# EAGLE design speculator_minor_mainboard_76mm_v1 (EAGLE 9.6.2)
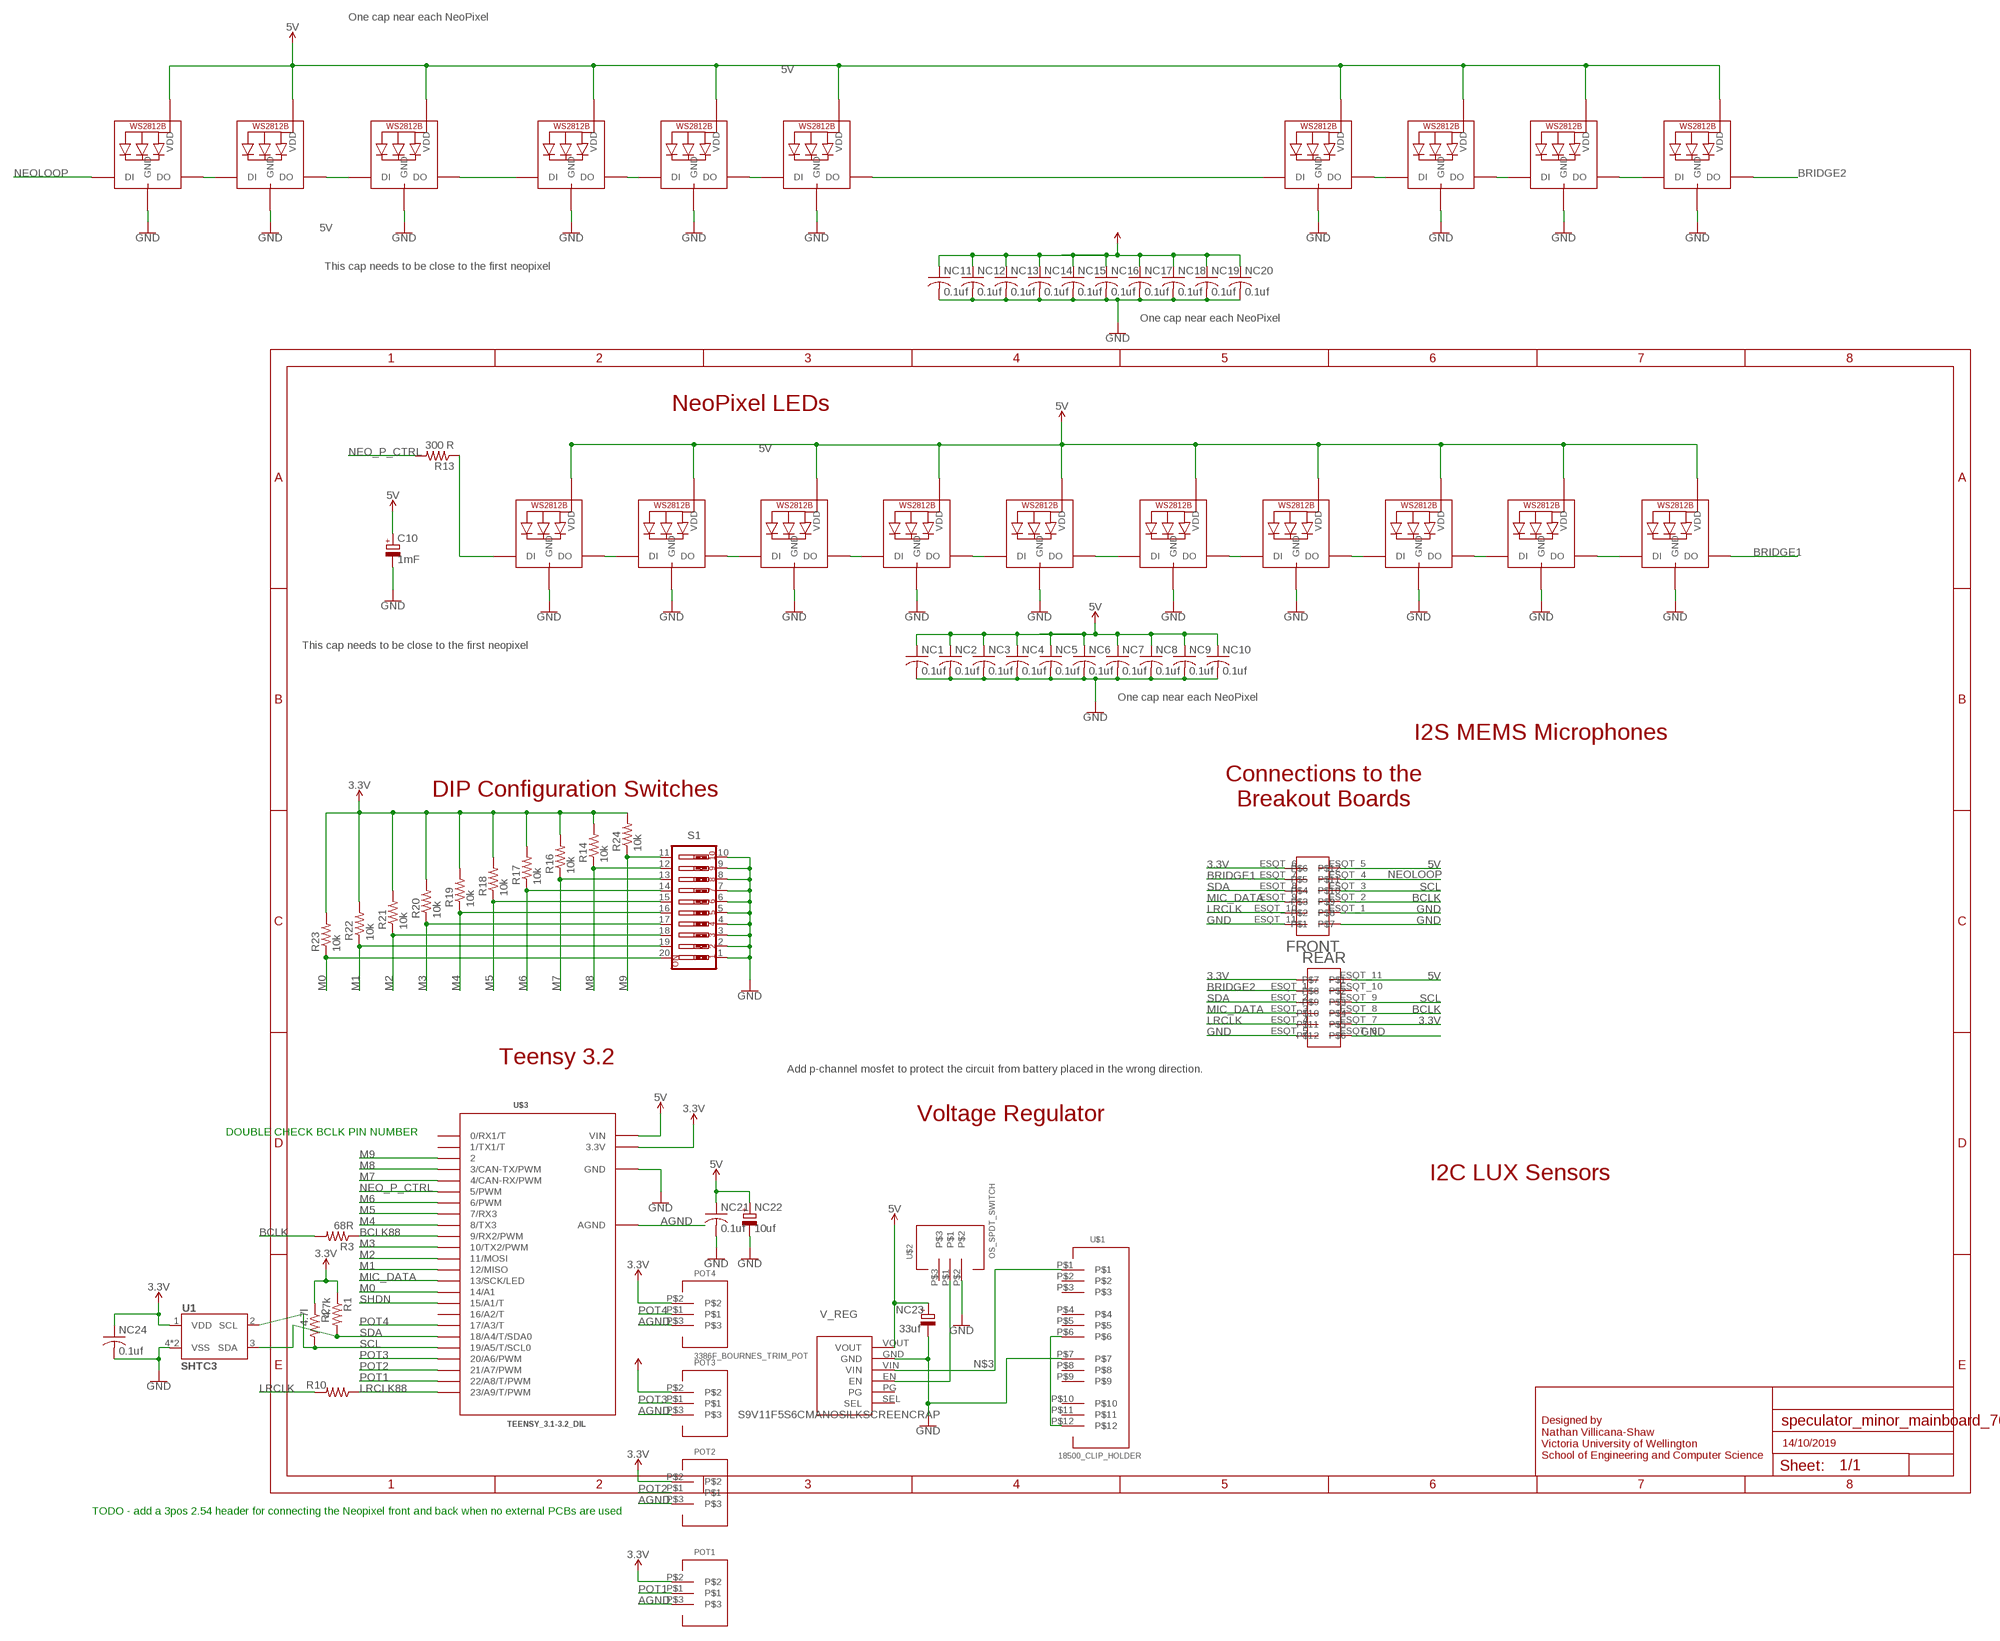
[diagram p0: schematic, sheet 1, part 1 of 2]
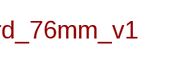
[diagram p1: schematic, sheet 1, part 2 of 2]

## Parts
C10  1mF  CPOL-EU153CLV-1010  [153CLV-1010]
FRONT  SAMTEC_ESQT_2X6_THROUGH_HOLE  [SAMTEC_ESQT_2X6_THROUGH_HOLE]
NC1  0.1uf  C-USC0805K  [C0805K]
NC2  0.1uf  C-USC0805K  [C0805K]
NC3  0.1uf  C-USC0805K  [C0805K]
NC4  0.1uf  C-USC0805K  [C0805K]
NC5  0.1uf  C-USC0805K  [C0805K]
NC6  0.1uf  C-USC0805K  [C0805K]
NC7  0.1uf  C-USC0805K  [C0805K]
NC8  0.1uf  C-USC0805K  [C0805K]
NC9  0.1uf  C-USC0805K  [C0805K]
NC10  0.1uf  C-USC0805K  [C0805K]
NC11  0.1uf  C-USC0805K  [C0805K]
NC12  0.1uf  C-USC0805K  [C0805K]
NC13  0.1uf  C-USC0805K  [C0805K]
NC14  0.1uf  C-USC0805K  [C0805K]
NC15  0.1uf  C-USC0805K  [C0805K]
NC16  0.1uf  C-USC0805K  [C0805K]
NC17  0.1uf  C-USC0805K  [C0805K]
NC18  0.1uf  C-USC0805K  [C0805K]
NC19  0.1uf  C-USC0805K  [C0805K]
NC20  0.1uf  C-USC0805K  [C0805K]
NC21  0.1uf  C-USC0805K  [C0805K]
NC22  10uf  CPOL-EUE2.5-7  [E2,5-7]
NC23  33uf  CPOL-EUE2.5-7  [E2,5-7]
NC24  0.1uf  C-USC0805K  [C0805K]
NEO1  WS2812B5050  [WS2812B]
NEO2  WS2812B5050  [WS2812B]
NEO3  WS2812B5050  [WS2812B]
NEO4  WS2812B5050  [WS2812B]
NEO5  WS2812B5050  [WS2812B]
NEO6  WS2812B5050  [WS2812B]
NEO7  WS2812B5050  [WS2812B]
NEO8  WS2812B5050  [WS2812B]
NEO9  WS2812B5050  [WS2812B]
NEO10  WS2812B5050  [WS2812B]
NEO11  WS2812B5050  [WS2812B]
NEO12  WS2812B5050  [WS2812B]
NEO13  WS2812B5050  [WS2812B]
NEO14  WS2812B5050  [WS2812B]
NEO15  WS2812B5050  [WS2812B]
NEO16  WS2812B5050  [WS2812B]
NEO17  WS2812B5050  [WS2812B]
NEO18  WS2812B5050  [WS2812B]
NEO19  WS2812B5050  [WS2812B]
NEO20  WS2812B5050  [WS2812B]
POT1  3386F_BOURNES_TRIM_POT  [3386_BOURNS_TRIM_POT]
POT2  3386F_BOURNES_TRIM_POT  [3386_BOURNS_TRIM_POT]
POT3  3386F_BOURNES_TRIM_POT  [3386_BOURNS_TRIM_POT]
POT4  3386F_BOURNES_TRIM_POT  [3386_BOURNS_TRIM_POT]
R1  4.7k  R-US_R0805  [R0805]
R2  4.7l  R-US_R0805  [R0805]
R3  68R  R-US_R0805  [R0805]
R10  68R  R-US_R0805  [R0805]
R13  300 R  R-US_R0805  [R0805]
R14  10k  R-US_R0805  [R0805]
R16  10k  R-US_R0805  [R0805]
R17  10k  R-US_R0805  [R0805]
R18  10k  R-US_R0805  [R0805]
R19  10k  R-US_R0805  [R0805]
R20  10k  R-US_R0805  [R0805]
R21  10k  R-US_R0805  [R0805]
R22  10k  R-US_R0805  [R0805]
R23  10k  R-US_M0805  [M0805]
R24  10k  R-US_R0805  [R0805]
REAR  SAMTEC_ESQT_2X6_THROUGH_HOLE  [SAMTEC_ESQT_2X6_THROUGH_HOLE]
S1  SW_DIP-10  [EDG-10]
U1  SHTC3  [SHTC3]
U$1  18500_CLIP_HOLDER  [3PINBATTERY_CLIP]
U$2  OS_SPDT_SWITCH  [OS_SPDT_SLIDE_SWITCH]
U$3  TEENSY_3.1-3.2_DIL  [TEENSY_3.0-3.2&LC_DIL]
V_REG  S9V11F5S6CMANOSILKSCREENCRAP  [S9V11F3S5CMA_BETTER_PINS]

## Nets
3.3V: FRONT.ESQT_6 NC24.1 POT1.P$2 POT2.P$2 POT3.P$2 POT4.P$2 R1.1 R2.1 R14.2 R16.2 R17.2 R18.2 R19.2 R20.2 R21.2 R22.2 R23.2 R24.2 REAR.ESQT_0 REAR.ESQT_7 U1.1(VDD) U$3.3.3V
5V: C10.+ FRONT.ESQT_5 NC1.1 NC2.1 NC3.1 NC4.1 NC5.1 NC6.1 NC7.1 NC8.1 NC9.1 NC10.1 NC11.1 NC12.1 NC13.1 NC14.1 NC15.1 NC16.1 NC17.1 NC18.1 NC19.1 NC20.1 NC21.1 NC22.+ NC23.+ NEO1.1-VDD(VDD) NEO2.1-VDD(VDD) NEO3.1-VDD(VDD) NEO4.1-VDD(VDD) NEO5.1-VDD(VDD) NEO6.1-VDD(VDD) NEO7.1-VDD(VDD) NEO8.1-VDD(VDD) NEO9.1-VDD(VDD) NEO10.1-VDD(VDD) NEO11.1-VDD(VDD) NEO12.1-VDD(VDD) NEO13.1-VDD(VDD) NEO14.1-VDD(VDD) NEO15.1-VDD(VDD) NEO16.1-VDD(VDD) NEO17.1-VDD(VDD) NEO18.1-VDD(VDD) NEO19.1-VDD(VDD) NEO20.1-VDD(VDD) REAR.ESQT_11 U$3.VIN V_REG.VOUT
AGND: POT1.P$3 POT2.P$3 POT3.P$3 POT4.P$3 U$3.AGND
BCLK: FRONT.ESQT_2 R3.2 REAR.ESQT_8
BCLK88: R3.1 U$3.9(9/RX2/PWM)
BRIDGE1: FRONT.ESQT_7 NEO10.2-DOUT(DO)
BRIDGE2: NEO20.2-DOUT(DO) REAR.ESQT_1
GND: C10.- FRONT.ESQT_0 FRONT.ESQT_1 FRONT.ESQT_11 NC1.2 NC2.2 NC3.2 NC4.2 NC5.2 NC6.2 NC7.2 NC8.2 NC9.2 NC10.2 NC11.2 NC12.2 NC13.2 NC14.2 NC15.2 NC16.2 NC17.2 NC18.2 NC19.2 NC20.2 NC21.2 NC22.- NC23.- NC24.2 NEO1.3-GND(GND) NEO2.3-GND(GND) NEO3.3-GND(GND) NEO4.3-GND(GND) NEO5.3-GND(GND) NEO6.3-GND(GND) NEO7.3-GND(GND) NEO8.3-GND(GND) NEO9.3-GND(GND) NEO10.3-GND(GND) NEO11.3-GND(GND) NEO12.3-GND(GND) NEO13.3-GND(GND) NEO14.3-GND(GND) NEO15.3-GND(GND) NEO16.3-GND(GND) NEO17.3-GND(GND) NEO18.3-GND(GND) NEO19.3-GND(GND) NEO20.3-GND(GND) REAR.ESQT_5 REAR.ESQT_6 S1.1 S1.2 S1.3 S1.4 S1.5 S1.6 S1.7 S1.8 S1.9 S1.10 U1.4(VSS) U1.5(VSS) U$1.P$7 U$2.P$2 U$3.GND V_REG.GND
LRCLK: FRONT.ESQT_10 R10.2 REAR.ESQT_4
LRCLK88: R10.1 U$3.23/A9(23/A9/T/PWM)
M0: R23.1 S1.20 U$3.14/A0(14/A1)
M1: R22.1 S1.19 U$3.12(12/MISO)
M2: R21.1 S1.18 U$3.11(11/MOSI)
M3: R20.1 S1.17 U$3.10(10/TX2/PWM)
M4: R19.1 S1.16 U$3.8(8/TX3)
M5: R18.1 S1.15 U$3.7(7/RX3)
M6: R17.1 S1.14 U$3.6(6/PWM)
M7: R16.1 S1.13 U$3.4(4/CAN-RX/PWM)
M8: R14.1 S1.12 U$3.3(3/CAN-TX/PWM)
M9: R24.1 S1.11 U$3.2
MIC_DATA: FRONT.ESQT_9 REAR.ESQT_3 U$3.13(13/SCK/LED)
N$1: U$1.P$6 U$1.P$12
N$3: U$1.P$1 V_REG.VIN
N$4: NEO2.2-DOUT(DO) NEO3.4-DIN(DI)
N$5: NEO5.2-DOUT(DO) NEO6.4-DIN(DI)
N$6: NEO9.2-DOUT(DO) NEO10.4-DIN(DI)
N$7: NEO11.2-DOUT(DO) NEO12.4-DIN(DI)
N$8: NEO4.2-DOUT(DO) NEO5.4-DIN(DI)
N$9: NEO15.2-DOUT(DO) NEO16.4-DIN(DI)
N$10: NEO3.2-DOUT(DO) NEO4.4-DIN(DI)
N$11: NEO7.2-DOUT(DO) NEO8.4-DIN(DI)
N$12: NEO8.2-DOUT(DO) NEO9.4-DIN(DI)
N$14: NEO18.2-DOUT(DO) NEO19.4-DIN(DI)
N$15: NEO13.2-DOUT(DO) NEO14.4-DIN(DI)
N$16: NEO16.2-DOUT(DO) NEO17.4-DIN(DI)
N$18: NEO12.2-DOUT(DO) NEO13.4-DIN(DI)
N$19: NEO19.2-DOUT(DO) NEO20.4-DIN(DI)
N$23: NEO6.2-DOUT(DO) NEO7.4-DIN(DI)
N$1343: NEO17.2-DOUT(DO) NEO18.4-DIN(DI)
NEO_P1: NEO1.2-DOUT(DO) NEO2.4-DIN(DI)
NEO_P2: NEO14.2-DOUT(DO) NEO15.4-DIN(DI)
NEO_P_CTRL: R13.2 U$3.5(5/PWM)
NEO_P_CTRL_INT: NEO1.4-DIN(DI) R13.1
NEOLOOP: FRONT.ESQT_4 NEO11.4-DIN(DI)
POT1: POT1.P$1 U$3.22/A8(22/A8/T/PWM)
POT2: POT2.P$1 U$3.21/A7(21/A7/PWM)
POT3: POT3.P$1 U$3.20/A6(20/A6/PWM)
POT4: POT4.P$1 U$3.17/A3(17/A3/T)
SCL: FRONT.ESQT_3 R2.2 REAR.ESQT_9 U1.2(SCL) U$3.19/A5(19/A5/T/SCL0)
SDA: FRONT.ESQT_8 R1.2 REAR.ESQT_2 U1.3(SDA) U$3.18/A4(18/A4/T/SDA0)
SHDN: U$2.P$1 U$3.15/A1(15/A1/T) V_REG.EN
Unconnected: REAR.ESQT_10 U$1.P$2 U$1.P$3 U$1.P$4 U$1.P$5 U$1.P$8 U$1.P$9 U$1.P$10 U$1.P$11 U$2.P$3 U$3.0(0/RX1/T) U$3.1(1/TX1/T) U$3.16/A2(16/A2/T) V_REG.PG V_REG.SEL

## Notes on the sheet
- One cap near each NeoPixel
- This cap needs to be close to the first neopixel
- One cap near each NeoPixel
- NeoPixel LEDs
- This cap needs to be close to the first neopixel
- One cap near each NeoPixel
- I2S MEMS Microphones
- Connections to the
  Breakout Boards
- DIP Configuration Switches
- Teensy 3.2
- Add p-channel mosfet to protect the circuit from battery placed in the wrong direction.
- Voltage Regulator
- DOUBLE CHECK BCLK PIN NUMBER
- I2C LUX Sensors
- 14/10/2019
- Designed by
  Nathan Villicana-Shaw
  Victoria University of Wellington
  School of Engineering and Computer Science
- TODO - add a 3pos 2.54 header for connecting the Neopixel front and back when no external PCBs are used

## Library data of the parts
C10 NC22 NC23 = rcl:CPOL-EU: POLARIZED CAPACITOR, European symbol; SPICEPREFIX: C
FRONT REAR = nathans-custom-parts:SAMTEC_ESQT_2X6_THROUGH_HOLE
NC1-NC21 NC24 = resistor:C-US: CAPACITOR, American symbol
NEO1-NEO20 = nathans-custom-parts:WS2812B
POT1-POT4 = nathans-custom-parts:3386F_BOURNES_TRIM_POT
R1-R3 R10 R13 R14 R16-R22 R24 = audio amplifier example:R-US_: RESISTOR, American symbol
R23 = resistor:R-US_: RESISTOR, American symbol
S1 = special:SW_DIP-10: DIP SWITCH
U1 = SHTC3:SHTC3
U$1 = nathans-custom-parts:18500_CLIP_HOLDER; SPICEPREFIX: X
U$2 = nathans-custom-parts:OS_SPDT_SWITCH
U$3 = Teensy_3_and_LC_Series_Boards_v1.4:TEENSY_3.1-3.2_DIL: Teensy 3.1 or 3.2 in a DIL Layout.
V_REG = nathans-custom-parts:S9V11F5S6CMA

## Net classes
0 default: width 0.203 mm, drill 0.254 mm, clearance 0.152 mm

## Board
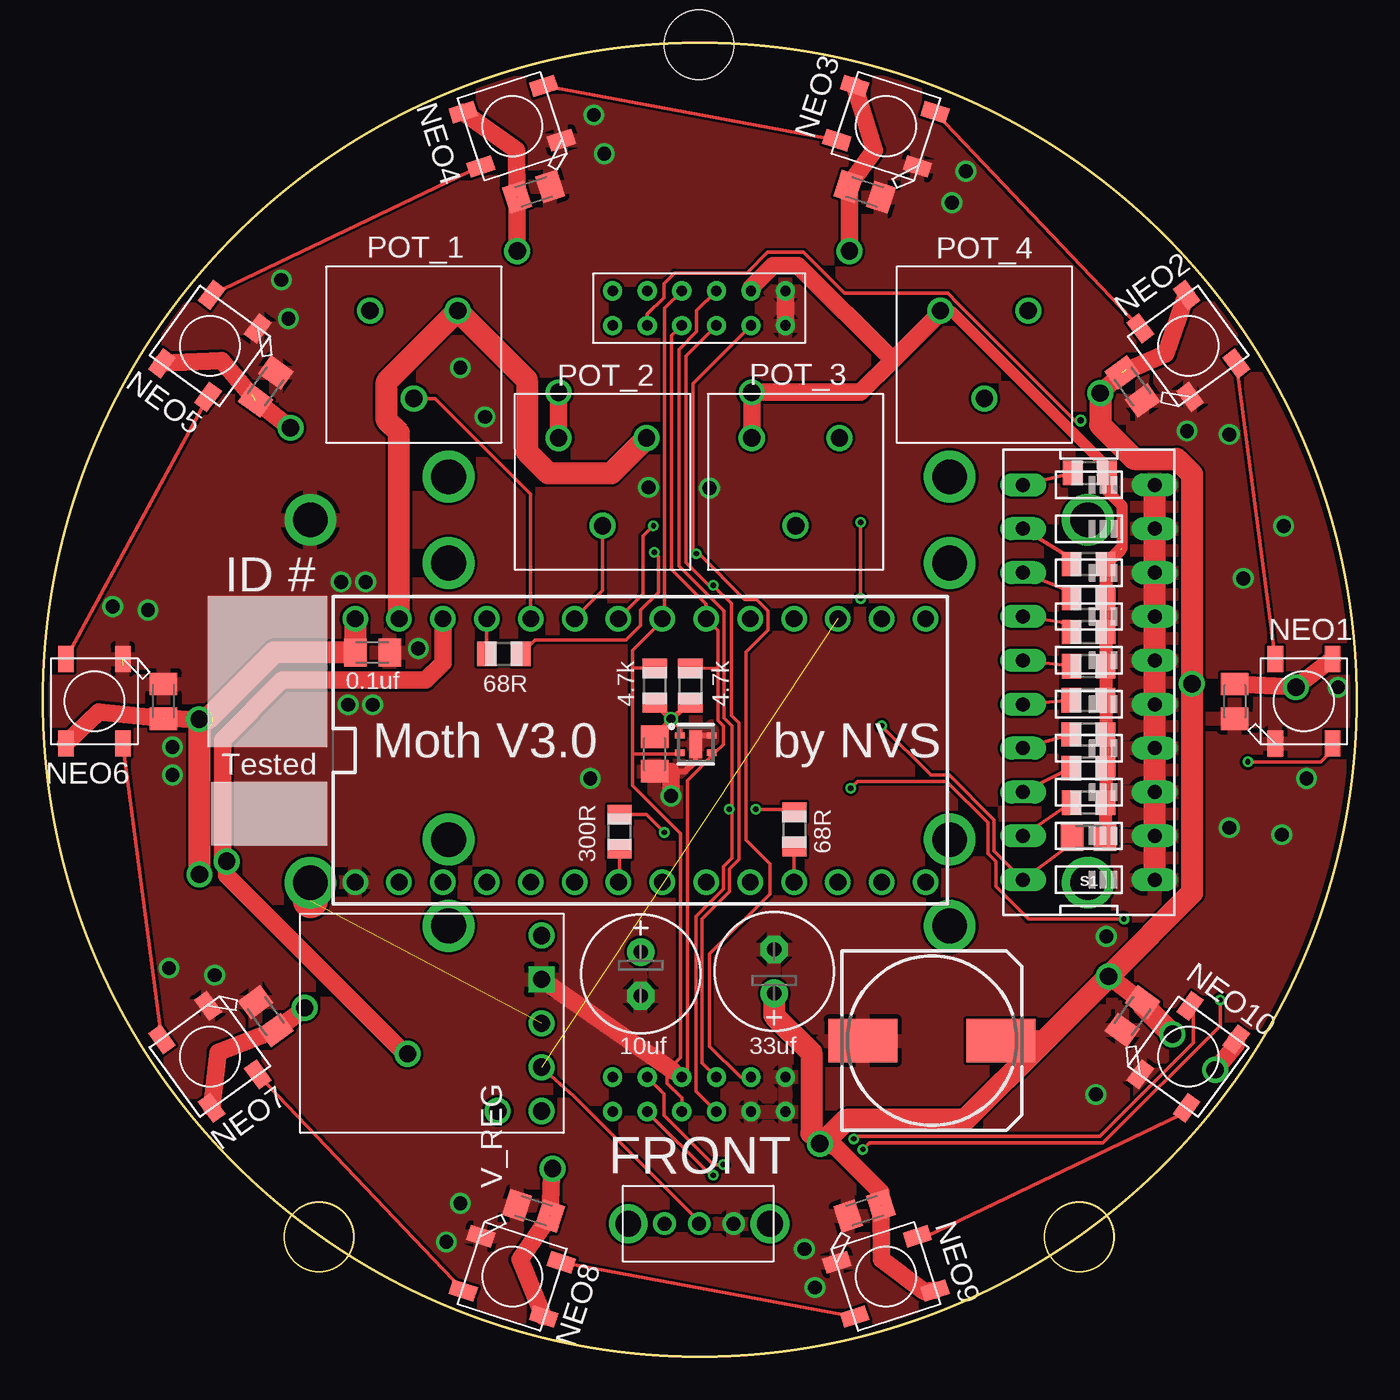
[diagram p2: board, top side]
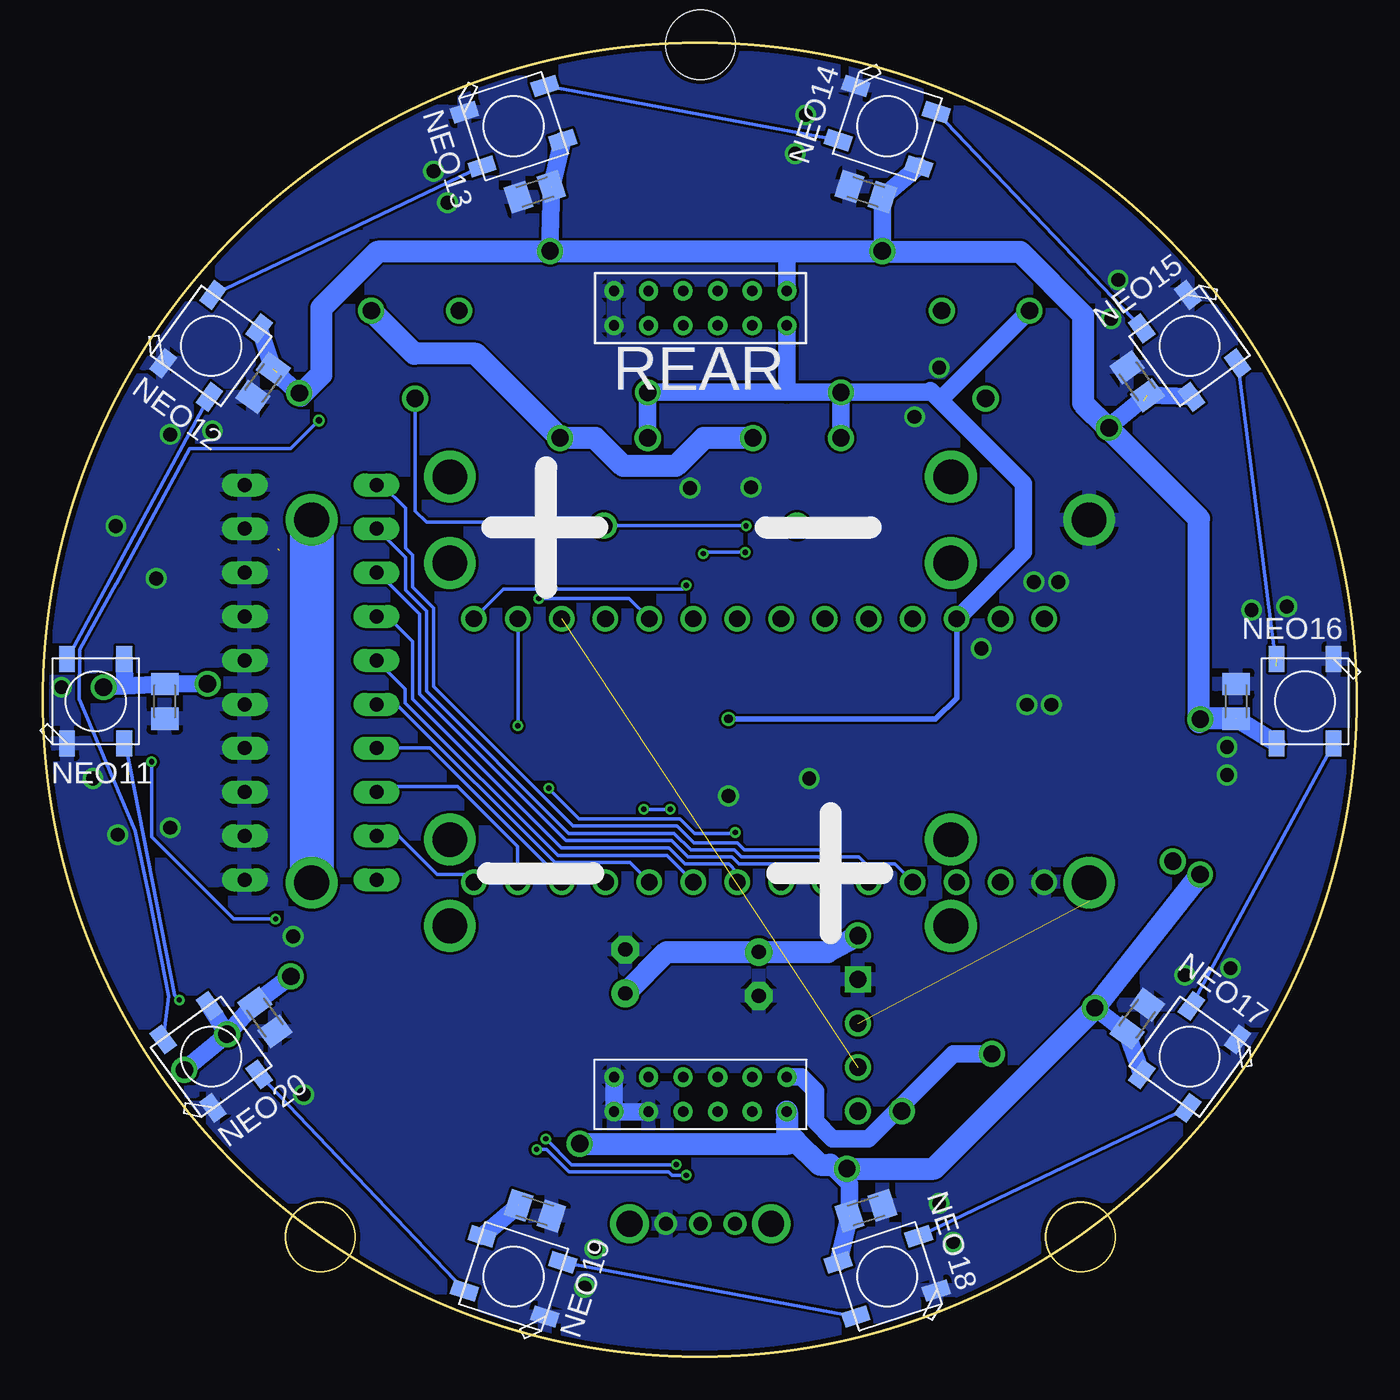
[diagram p3: board, bottom side, seen from below]

Size 76 x 76 mm. Coordinates in mm from the lower left corner, seen from the top.
Outline: circle at 15.96,6.91 radius 2
Outline: circle at 59.96,6.91 radius 2
Outline: circle at 38,38 radius 38
Copper layers (1*16): Top 0.035mm / dielectric 1.5mm / Bottom 0.035mm
Design rules "SeeedStudio_2layer_DRU_no_angle_20140221": minimum track width 6mil, minimum drill 12mil, track to track 6mil, track to pad 6mil, pad to pad 6mil, via to via 6mil, smd to smd 0mil, copper to edge 10mil, drill to drill 10mil, minimum pad ring 10mil, minimum via ring 6mil, stop-mask expansion 2mil, vias tented up to drill 100mil, thermal gap 10mil
Holes 4 mm at 15.96,6.91 59.96,6.91 37.96,75.91

### Footprints (pad centres in the part's own frame; a part is rotated, then mirrored left to right if it is on the bottom)
153CLV-1010 = smd 4 x 2.5: + 4,0; - -4,0
SAMTEC_ESQT_2X6_THROUGH_HOLE = drill 0.6: ESQT_0 -5,-1; ESQT_1 -3,-1; ESQT_2 -1,-1; ESQT_3 1,-1; ESQT_4 3,-1; ESQT_5 5,-1; ESQT_6 5,1; ESQT_7 3,1; ESQT_8 1,1; ESQT_9 -1,1; ESQT_10 -3,1; ESQT_11 -5,1
C0805K = smd 1.3 x 1.6: 1 -1,0; 2 1,0
E2,5-7 = drill 0.813 pad 1.6: + -1.27,0 | drill 0.813 pad 1.6 octagon: - 1.27,0
WS2812B = smd 1.5 x 0.9: 1-VDD 2.45,-1.65; 2-DOUT 2.45,1.65; 3-GND -2.45,1.65; 4-DIN -2.45,-1.65
3386_BOURNS_TRIM_POT = drill 1: P$1 0,-2.54; P$2 -2.54,2.54; P$3 2.54,2.54
R0805 = smd 1.1 x 1.4: 1 -1,0; 2 1,0
M0805 = smd 1.3 x 1.6: 1 -0.95,0; 2 0.95,0
EDG-10 = drill 0.813 long: 1 -11.43,-3.81; 2 -8.89,-3.81; 3 -6.35,-3.81; 4 -3.81,-3.81; 5 -1.27,-3.81; 6 1.27,-3.81; 7 3.81,-3.81; 8 6.35,-3.81; 9 8.89,-3.81; 10 11.43,-3.81; 11 11.43,3.81; 12 8.89,3.81; 13 6.35,3.81; 14 3.81,3.81; 15 1.27,3.81; 16 -1.27,3.81; 17 -3.81,3.81; 18 -6.35,3.81; 19 -8.89,3.81; 20 -11.43,3.81
SHTC3 = smd 0.55 x 0.35: 1 -0.925,0.5; 2 -0.925,-0.5; 3 0.925,-0.5; 4 0.925,0.5 | smd 0.7 x 1.6: 5 0,0
3PINBATTERY_CLIP = drill 2: P$1 -22.5,10.5; P$2 -14.5,13; P$3 -14.5,8; P$4 14.5,13; P$5 14.5,8; P$6 22.5,10.5; P$7 -22.5,-10.5; P$8 -14.5,-8; P$9 -14.5,-13; P$10 14.5,-8; P$11 14.5,-13; P$12 22.5,-10.5
OS_SPDT_SLIDE_SWITCH = drill 0.8: P$1 0,0; P$2 2,0; P$3 -2,0 | drill 1.5: P$4 4.1,0; P$5 -4.1,0
TEENSY_3.0-3.2&LC_DIL = drill 0.965: 0 -7.62,13.97; 1 -7.62,11.43; 2 -7.62,8.89; 3 -7.62,6.35; 3.3V 7.62,11.43; 4 -7.62,3.81; 5 -7.62,1.27; 6 -7.62,-1.27; 7 -7.62,-3.81; 8 -7.62,-6.35; 9 -7.62,-8.89; 10 -7.62,-11.43; 11 -7.62,-13.97; 12 -7.62,-16.51; 13 7.62,-16.51; 14/A0 7.62,-13.97; 15/A1 7.62,-11.43; 16/A2 7.62,-8.89; 17/A3 7.62,-6.35; 18/A4 7.62,-3.81; 19/A5 7.62,-1.27; 20/A6 7.62,1.27; 21/A7 7.62,3.81; 22/A8 7.62,6.35; 23/A9 7.62,8.89; AGND 7.62,13.97; GND -7.62,16.51; VIN 7.62,16.51
S9V11F3S5CMA_BETTER_PINS = drill 1: EN 3.81,1.27; PG 1.27,1.27; SEL 1.27,3.81; VIN 6.35,1.27; VOUT 11.43,1.27 | drill 1 square: GND 8.89,1.27

### Placement (x,y rotation side)
C10  51.44,18.27 0 top
FRONT  37.96,15.16 0 bottom
NC1  68.96,37.91 270 top
NC2  63.04,56.13 306 top
NC3  47.54,67.39 342 top
NC4  28.38,67.39 18 top
NC5  12.88,56.13 54 top
NC6  6.96,37.91 90 top
NC7  12.88,19.69 126 top
NC8  28.38,8.43 162 top
NC9  47.54,8.43 198 top
NC10  63.04,19.69 234 top
NC11  68.96,37.91 270 bottom
NC12  63.27,56.34 234 bottom
NC13  47.54,67.39 198 bottom
NC14  28.38,67.39 162 bottom
NC15  12.68,56.44 126 bottom
NC16  6.96,37.91 90 bottom
NC17  12.68,19.54 54 bottom
NC18  28.38,8.43 18 bottom
NC19  47.54,8.43 342 bottom
NC20  63.17,19.61 306 bottom
NC21  19.06,40.74 0 top
NC22  34.59,22.13 270 top
NC23  42.31,22.27 90 top
NC24  35.39,34.86 270 top
NEO1  72.96,37.91 90 top
NEO2  66.28,58.48 126 top
NEO3  48.78,71.2 162 top
NEO4  27.15,71.2 198 top
NEO5  9.65,58.48 234 top
NEO6  2.96,37.91 270 top
NEO7  9.65,17.34 306 top
NEO8  27.15,4.62 342 top
NEO9  48.78,4.62 18 top
NEO10  66.28,17.34 54 top
NEO11  72.96,37.91 90 bottom
NEO12  66.28,58.48 54 bottom
NEO13  48.78,71.2 18 bottom
NEO14  27.15,71.2 342 bottom
NEO15  9.65,58.48 306 bottom
NEO16  2.96,37.91 270 bottom
NEO17  9.65,17.34 234 bottom
NEO18  27.15,4.62 198 bottom
NEO19  48.78,4.62 162 bottom
NEO20  66.28,17.34 126 bottom
POT1  21.45,57.98 0 top
POT2  32.37,50.61 0 top
POT3  43.55,50.61 0 top
POT4  54.47,57.98 0 top
R1  37.45,38.83 90 top
R2  35.4,38.83 90 top
R3  43.47,30.49 90 top
R10  26.66,40.66 0 top
R13  33.35,30.35 270 top
R14  60.52,45.85 0 top
R16  60.5,43.89 0 top
R17  60.5,41.92 0 top
R18  60.5,39.94 0 top
R19  60.49,37.97 0 top
R20  60.49,35.99 0 top
R21  60.49,34.04 0 top
R22  60.5,32.04 0 top
R23  60.5,30.05 0 top
R24  60.58,51.13 0 top
REAR  37.96,60.66 0 top
S1  60.52,39.01 90 top
U1  37.77,35.43 0 top
U$1  37.96,37.91 180 bottom
U$2  37.96,7.67 0 top
U$3  34.56,35.07 90 top
V_REG  30.12,12.92 90 top

### Tracks (layer width: path | path; a pad name or v marks a point on that pad's centre or on a via)
3.3V  (via drill 0.5, 1)  (1 unrouted)
  Top 0.305: U1.1 36.85,36.39 v36.34,36.9 | NC24.1 35.46,35.94 v36.34,36.9 | v36.34,36.9 R1.1 | v36.34,36.9 R2.1
  Top 0.635: 62.43,46.76 62.43,49.23 61.58,50.08 R24.2 61.58,51.48 52.59,60.47 51.98,60.47 POT4.P$2 | 61.52,44.01 61.52,39.94 61.52,37.71 61.52,35.88 61.52,33.85 61.52,30.11 R23.2
  Top 0.762: 62.33,46.67 R14.2 61.52,44.01 | R16.2 R17.2 61.52,39.94 | R18.2 61.52,37.71 | R19.2 61.52,35.88 | R20.2 61.52,33.85 | R21.2 R22.2 R23.2
  Top 1.016: v41.01,55.79 47.31,55.79 49.17,57.65 | 49.17,57.65 51.93,60.42 POT4.P$2 | 40.96,55.84 v41.01,55.79 | POT3.P$2 v41.01,55.79 | POT2.P$2 v29.83,55.79 | REAR.ESQT_7 40.96,61.86 42.23,63.13 43.69,63.13 49.17,57.65 | U$3.3.3V 23.13,40.14 22.13,39.13 13.83,39.13 10.38,35.68 10.38,28.89 v10.62,28.65 10.62,27.84 20.95,17.51 v21.1,17.51
  Bottom 0.305: v36.34,36.9 24.35,36.9 23.13,38.11 U$3.3.3V
  Bottom 1.016: POT2.P$2 v29.83,55.79 | v29.83,55.79 32.96,55.79 | 32.96,55.79 v41.01,55.79 POT3.P$2 | REAR.ESQT_0 32.96,55.79 | v29.83,55.79 24.75,55.79 24.65,55.89 24.14,55.39 | 24.14,55.39 19.27,50.51 19.27,46.54 U$3.3.3V | POT1.P$2 24.04,55.39 24.14,55.39 | v21.1,17.51 23.33,17.51 28.24,12.59 29.75,12.59 29.75,12.6 30.31,12.6 31.3,13.59 31.3,15.36 32.1,16.16 FRONT.ESQT_6
5V  (via drill 1)  (7 unrouted)
  Top 1.016: NC10.1 v61.67,21.99 | NEO10.1-VDD 69.05,18.06 v67.83,16.58 | NC11.1 v72.51,38.72 NEO1.1-VDD | NEO2.1-VDD 64.99,58.03 NC2.1 v61.18,55.74 | NEO3.1-VDD 48.12,69.81 NC13.1 46.66,67.63 v46.66,63.97 | NEO4.1-VDD 27.4,69.81 NC14.1 v27.43,63.97 | NEO5.1-VDD 10.33,57.62 NC5.1 v14.31,53.74 | v9.03,36.87 NC16.1 3.21,37.3 NEO6.1-VDD | NEO7.1-VDD 10.12,17.59 NC7.1 15,20.03 v15.14,20.17 | NEO8.1-VDD 27.6,5.6 NC18.1 29.43,10.48 v29.47,10.86 | NEO9.1-VDD 50.97,3.77 48.53,5.6 NC19.1 48.49,9.49 45.89,12.09 45.08,12.31
  Top 1.27: U$3.VIN NC21.1 13.36,40.74 9.51,36.9 9.06,36.9 v9.03,36.87 9.03,28.6 v9.04,27.89 | 6.98,36.9 NC16.1 | v61.18,55.74 61.18,53.91 63.15,51.94 65.61,51.94 66.49,51.06 v66.49,38.93 66.49,26.81 v61.67,21.99 57.88,18.2 | NC23.+ 42.31,19.75 44.46,17.59 44.46,12.93 45.08,12.31 | 45.08,12.31 v44.95,12.31 | 45.08,12.31 46.45,13.68 53.35,13.68 57.88,18.2 | C10.+ 57.81,18.27 57.88,18.2 | v65.36,18.64 63.63,20.37 NC10.1
  Bottom 1.016: REAR.ESQT_11 32.96,63.84 32.88,63.92 | 30.44,11.09 29.33,9.98 NC18.1 NEO18.1-VDD | NEO17.1-VDD NC17.1 v15.14,20.17 | NEO16.1-VDD NC16.1 | NEO15.1-VDD NC15.1 14.39,53.76 | NEO19.1-VDD NC19.1 | NEO14.1-VDD NC14.1 27.43,64.16 | NEO13.1-VDD NC13.1 46.7,63.92 | 61.13,55.59 NC12.1 NEO12.1-VDD | v66.49,38.93 NC11.1 71.29,38.79 | 71.29,38.79 v72.51,38.72 | NEO11.1-VDD 71.29,38.79 | v61.67,21.99 NC20.1 v65.36,18.64 | v65.36,18.64 v67.83,16.58 | NEO20.1-VDD v65.36,18.64
  Bottom 1.27: 27.19,63.92 19.47,63.92 15.81,60.26 15.81,55.18 14.39,53.76 9.11,48.48 9.11,36.69 8.89,36.91 NC16.1 | 27.19,63.92 32.88,63.92 46.7,63.92 56.66,63.92 59.91,60.67 59.91,56.81 61.13,55.59 | 61.13,55.59 | 27.43,64.16 27.19,63.92 | 30.44,11.09 31.05,11.09 32.48,12.51 32.96,12.51 FRONT.ESQT_5 32.96,13.61 | v44.95,12.31 32.88,12.31 32.96,12.39 | V_REG.VOUT 30.6,23.4 NC22.+ 39.91,23.4 NC23.+ | v29.47,10.86 24.45,10.86 v15.14,20.17 v9.04,27.89
AGND
  Top 1.27: POT2.P$3 32.88,51.12 29.22,51.12 28,52.34 28,56.5 POT1.P$3 19.88,56.4 19.88,54.17 20.59,53.45 U$3.AGND
  Bottom 1.27: POT2.P$3 37.76,53.15 39.38,51.53 42.43,51.53 44.06,53.15 POT3.P$3 50.97,58.03 54.52,58.03 POT4.P$3
BCLK  (via drill 0.3)
  Top 0.203: REAR.ESQT_8 37.82,60.52 37.82,59.31 36.79,58.27 36.79,45.75 39.42,43.12 39.42,36.94 39.87,36.49 39.87,31.74 | FRONT.ESQT_2 37.79,15.33 37.79,25.46 39.37,27.04 39.37,28.34 39.87,28.84 39.87,31.74 | R3.2 43.3,31.66 v41.24,31.66 | v39.71,31.66 39.79,31.66 39.87,31.74
  Bottom 0.203: v41.24,31.66 v39.71,31.66
BCLK88
  Top 0.203: U$3.9 43.45,29.48 R3.1
BRIDGE1  (via drill 0.3)
  Top 0.203: FRONT.ESQT_7 35.93,15.19 35.93,13.95 38.79,11.09 v39.36,11.09 | v46.9,12.58 47.04,12.72 61.16,12.72 66.57,18.14 66.57,20.1 NEO10.2-DOUT
  Bottom 0.203: v39.36,11.09 45.41,11.09 v46.9,12.58
BRIDGE2  (via drill 0.38)
  Top 0.203: REAR.ESQT_1 34.96,60.31 35.93,61.28 35.93,62.09 36.54,62.7 40.73,62.7 41.92,63.89 44,63.89 46.37,61.53 52.35,61.53 52.94,60.94 52.94,60.93 59.91,53.96 60.05,54.1 v60.05,54.16
  Bottom 0.203: v60.05,54.16 61.67,52.54 67.52,52.54 71.76,44.71 73.88,40.9 73.9,38.06 70.68,30.39 69.84,26.46 68.73,20.85 68.73,20.84 NEO20.2-DOUT
GND  (via drill 0.8)
  Top 0.305: U1.4 37.91,35.94 37.76,36.08 37.76,35.45 | 37.76,35.45 U1.5 | NC24.2 36.34,33.86 37.16,33.86 37.76,34.46 37.76,35.45
  Top 1.016: REAR.ESQT_6 REAR.ESQT_5 | v36.34,32.43 36.34,33.86 | V_REG.GND 36.45,16.52
  Top 1.27: S1.1 S1.2 S1.3 S1.4 S1.5 S1.6 S1.7 S1.8 S1.9 S1.10
  Bottom 1.016: FRONT.ESQT_11 FRONT.ESQT_0 FRONT.ESQT_1
  other vias: 60.92,15.15 61.53,24.3 44.67,3.98 44.06,6.21 23.33,6.62 24.14,8.85 7.28,22.47 9.92,22.06 4.03,43.4 6.06,43.19 13.78,62.3 14.19,60.06 31.87,71.85 32.48,69.61 53.41,68.59 52.59,66.77 68.65,53.35 66.21,53.56 71.79,48.06 69.46,45.02 31.66,33.44 17.64,37.71 19.06,37.71 17.24,44.82 18.66,44.82 24.14,57.22 25.57,54.37 7.48,35.27 7.48,33.64 21.71,40.96 35.03,50.29 38.56,50.26 74.94,38.72 73.12,33.44 71.69,30.19 68.65,30.6
  pour Top: -20.04,86.91 90.96,86.91 90.96,-14.09 -20.04,-14.09
  pour Bottom: 59.73,86.81 90.87,55.67 90.87,17.85 58.61,-14.41 19.78,-14.41 -20.31,25.67 -20,86.83
LRCLK  (via drill 0.3)
  Top 0.203: R10.2 28.46,41.47 33.74,41.47 34.58,42.31 34.58,43.18 35.6,44.21 35.6,46.3 v35.36,46.54 | REAR.ESQT_4 37.6,56.3 37.6,46.66 v37.8,46.46 37.95,46.46 40.6,43.81 41.27,43.81 41.96,43.12 41.96,42.03 40.68,40.76 40.68,29.88 42.06,28.49 42.06,26.77 38.57,23.28 38.57,17.94 40.35,16.16 FRONT.ESQT_10
  Bottom 0.203: v37.8,46.46 37.72,46.54 v35.36,46.54
LRCLK88
  Top 0.203: R10.1 25.65,42.66 U$3.23/A9
M0  (via drill 0.3)
  Top 0.203: v48.53,36.49 51.38,33.64 52.44,33.64 55.03,31.04 55.03,29.26 S1.20 59.09,29.38 R23.1
  Bottom 0.203: v48.53,36.49 U$3.14/A0
M1
  Top 0.203: S1.19 R22.1
  Bottom 0.203: U$3.12 51.51,27.88 53.2,27.88 55.49,30.16 55.53,30.12 S1.19
M2
  Top 0.203: S1.18 R21.1
  Bottom 0.203: U$3.11 48.53,29.5 52.01,32.98 56.39,32.98 S1.18
M3
  Top 0.203: S1.17 R20.1
  Bottom 0.203: S1.17 56.88,35.21 53.6,35.21 45.99,27.6 U$3.10
M4
  Top 0.203: S1.16 R19.1
  Bottom 0.203: S1.16 56.86,37.73 55.53,37.73 46.38,28.58 42.04,28.58 U$3.8
M5
  Top 0.203: S1.15 R18.1
  Bottom 0.203: S1.15 55.05,38.61 55.05,37.82 46.21,28.98 39.91,28.98 U$3.7
M6
  Top 0.203: S1.14 59.08,42.47 R17.1
  Bottom 0.203: S1.14 56.08,42.82 54.62,41.37 54.62,38.05 46.01,29.43 39.78,29.43 38.84,28.49 37.94,28.49 36.31,28.49 35.83,28.01 U$3.6
M7
  Top 0.203: S1.13 59.09,44.41 R16.1
  Bottom 0.203: S1.13 56.61,45.36 54.22,42.96 54.22,38.32 45.75,29.85 39.62,29.85 38.67,28.9 36.15,28.9 35.74,28.49 32.86,28.49 31.26,28.49 30.75,27.99 U$3.4
M8
  Top 0.203: S1.12 59.09,46.45 R14.1
  Bottom 0.203: S1.12 55.03,46.22 55.03,44.35 53.81,43.13 53.81,38.5 45.58,30.27 39.48,30.27 38.5,29.3 35.98,29.3 35.57,28.9 31.09,28.9 30.68,28.49 29.07,28.49 28.21,27.64 U$3.3
M9
  Top 0.203: S1.11 R24.1
  Bottom 0.203: S1.11 56.38,50.44 55.03,49.09 55.03,46.79 54.62,46.39 54.62,44.52 53.4,43.3 53.4,38.76 45.34,30.7 39.32,30.7 38.34,29.71 35.81,29.71 35.4,29.3 30.92,29.3 30.52,28.9 28.78,28.9 28.37,28.49 26.72,28.49 U$3.2
MIC_DATA  (via drill 0.3)
  Top 0.203: REAR.ESQT_3 37.19,57.89 37.19,45.95 38.52,44.62 v38.78,44.62 39.82,43.58 39.82,37.1 40.27,36.65 40.27,28.75 39.72,28.2 39.72,26.89 38.14,25.32 38.14,16.98 FRONT.ESQT_9
  Bottom 0.203: v38.78,44.62 38.98,44.42 49.35,44.42 U$3.13
N$1
  Bottom 2.54: U$1.P$12 U$1.P$6
N$3  (1 unrouted)
  Top 2.032: 15.46,26.36 U$1.P$1
N$4
  Top 0.203: NEO2.2-DOUT NEO3.4-DIN
N$5
  Top 0.203: NEO5.2-DOUT NEO6.4-DIN
N$6
  Top 0.203: NEO10.4-DIN 65.7,13.92 51.11,6.95 NEO9.2-DOUT
N$7
  Bottom 0.203: NEO12.4-DIN NEO11.2-DOUT
N$8
  Top 0.203: NEO4.2-DOUT NEO5.4-DIN
N$9  (1 unrouted)
  Bottom 0.203: NEO15.2-DOUT 4.64,39.94
N$10
  Top 0.203: NEO3.2-DOUT NEO4.4-DIN
N$11
  Top 0.203: NEO7.2-DOUT NEO8.4-DIN
N$12
  Top 0.203: NEO8.2-DOUT NEO9.4-DIN
N$14
  Bottom 0.203: NEO18.2-DOUT NEO19.4-DIN
N$15
  Bottom 0.203: NEO14.4-DIN NEO13.2-DOUT
N$16
  Bottom 0.203: NEO16.2-DOUT NEO17.4-DIN
N$18
  Bottom 0.203: NEO13.4-DIN NEO12.2-DOUT
N$19
  Bottom 0.203: NEO19.2-DOUT NEO20.4-DIN
N$23
  Top 0.203: NEO6.2-DOUT NEO7.4-DIN
N$1343
  Bottom 0.203: NEO17.2-DOUT NEO18.4-DIN
NEO_P1
  Top 0.203: NEO1.2-DOUT NEO2.4-DIN
NEO_P2
  Bottom 0.203: NEO15.4-DIN NEO14.2-DOUT
NEO_P_CTRL
  Top 0.203: U$3.5 33.35,27.51 R13.2
NEO_P_CTRL_INT  (via drill 0.3)
  Top 0.203: NEO1.4-DIN 74.61,35.07 73.95,34.41 v69.72,34.41 | R13.1 34.92,31.36 v35.95,30.32 | v62.55,25.31 57.02,25.31 55.13,27.2 55.13,28.65 54.67,29.11 54.67,30.9 52.29,33.28 47.14,33.28 v46.74,32.88
  Bottom 0.203: v35.95,30.32 36.02,30.25 38.3,30.25 39.16,31.1 44.97,31.1 v46.74,32.88 | v69.72,34.41 69.72,30.05 64.99,25.31 v62.55,25.31
NEOLOOP  (via drill 0.3)
  Top 0.203: FRONT.ESQT_4 38.64,10.48 v38.77,10.48 | v47.44,11.97 47.81,12.34 61.33,12.34 68.12,19.14 v68.12,20.63
  Bottom 0.203: v38.77,10.48 39.61,10.48 39.81,10.68 45.58,10.68 46.87,11.97 v47.44,11.97 | NEO11.4-DIN 71.24,35.39 68.38,20.88 v68.12,20.63
POT1
  Top 0.203: U$3.22/A8 28.21,49.89 22.67,55.44 POT1.P$1
POT2
  Top 0.203: U$3.21/A7 32.37,44.31 POT2.P$1
POT3  (via drill 0.3)
  Top 0.203: U$3.20/A6 34.71,44.11 34.71,47.46 v35.32,48.07
  Bottom 0.203: v35.32,48.07 POT3.P$1
POT4  (via drill 0.3)
  Top 0.203: v47.31,43.86 v47.31,48.27
  Bottom 0.203: U$3.17/A3 42.08,43.86 v47.31,43.86 | v47.31,48.27 53.81,48.27 54.47,48.94 POT4.P$1
SCL
  Top 0.203: REAR.ESQT_9 35.97,60.67 35.97,42.83 U$3.19/A5 35.83,42.59 34.1,40.85 34.1,39.83 | FRONT.ESQT_3 36.96,14.95 36.1,15.81 36.1,16.55 36.87,17.32 36.87,30.26 34.1,33.03 34.1,34.86 | 34.1,34.86 34.1,39.83 | U1.2 36.77,34.86 34.1,34.86 | R2.2 34.1,39.83
SDA
  Top 0.203: REAR.ESQT_2 36.38,59.08 36.38,45.55 38.37,43.55 U$3.18/A4 39.06,42 39.06,39.82 | FRONT.ESQT_8 37.28,16.48 37.28,33.33 38.88,34.93 | 39.06,39.82 39.06,36.79 39.37,36.48 39.37,35.42 38.88,34.93 | R1.2 38.65,39.82 39.06,39.82 | U1.3 38.88,34.93
SHDN  (1 unrouted)
  Top 0.203: V_REG.EN 30.73,15.04 37.96,7.82 U$2.P$1

### Text on the board
tPlace: 0.1uf | 4.7k | 4.7k | 68R | 10uf | 33uf
tNames: POT_1 | POT_4 | POT_2 | POT_3 | ID # | Moth V3.0 | by NVS | Tested | 300R